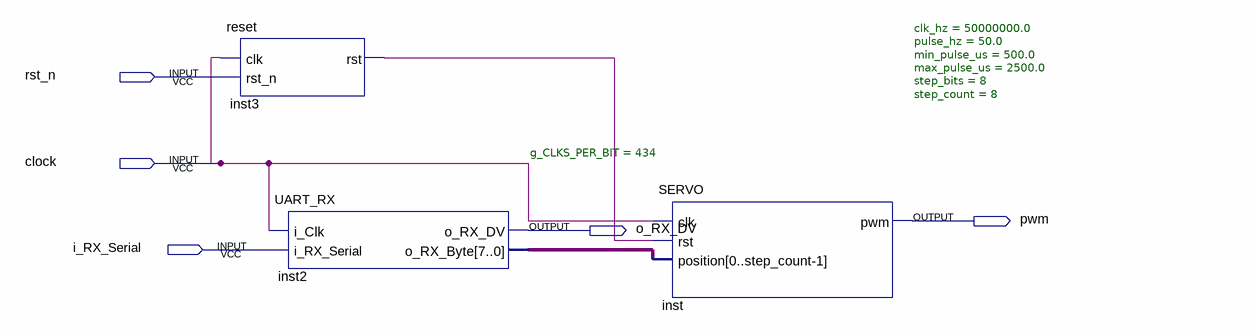
[diagram p0: schematic sheet]
// Quartus schematic SERVOUART.bdf as structural Verilog: 3 symbols, 5 pins
module SERVOUART (
  input  rst_n,
  input  clock,
  input  i_RX_Serial,
  output pwm,
  output o_RX_DV
);

  wire inst3_rst;
  wire [7:0] inst2_o_rx_byte;

  reset inst3 (.clk(clock), .rst_n(rst_n), .rst(inst3_rst));
  UART_RX #(.g_CLKS_PER_BIT(434)) inst2 (
    .i_Clk(clock), .i_RX_Serial(i_RX_Serial), .o_RX_DV(o_RX_DV), .o_RX_Byte(inst2_o_rx_byte));
  SERVO #(.clk_hz(50000000.0), .pulse_hz(50.0), .min_pulse_us(500.0), .max_pulse_us(2500.0), .step_bits(8), .step_count(8)) inst (
    .clk(clock), .rst(inst3_rst), .position(inst2_o_rx_byte), .pwm(pwm));
endmodule
